# Altium project Hospital-Smart-Bracelet.PrjPcb
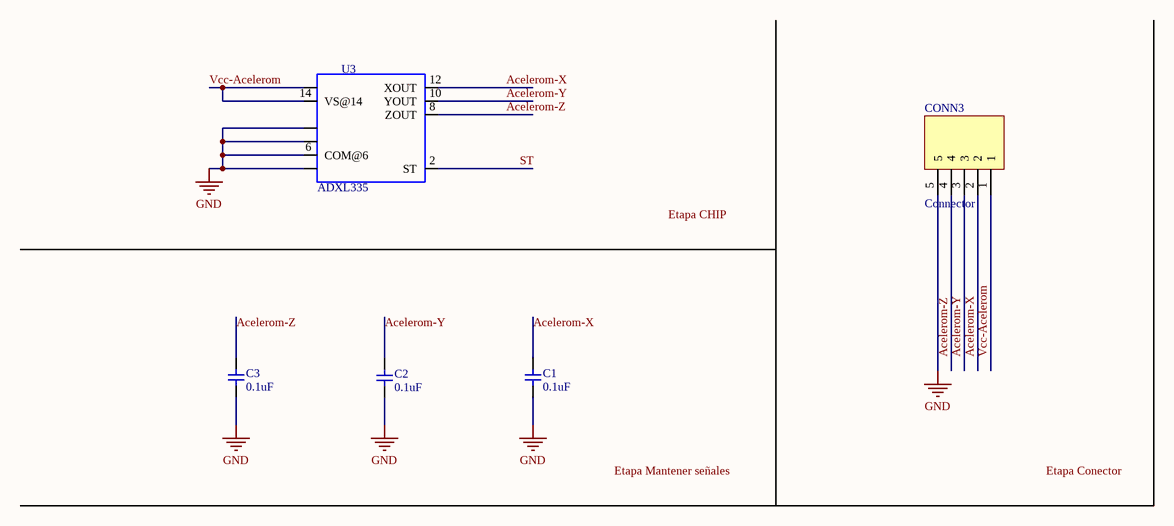
[diagram p0: SensorCaida.SchDoc]
7 sheets, 30 parts. Net scope: global (net labels, ports and power ports of the same name join across sheets).
Board file: HSB-Version1.PcbDoc
Sheets:
  SensorCaida.SchDoc
  Temperatura.SchDoc
  Atmega328P.SchDoc
  Proximidad.SchDoc
  CargaInalambrica.SchDoc
  BLE-HM10.SchDoc
  PPM.SchDoc

## Sheet SensorCaida.SchDoc
size A4

### Parts
C1  value 0.1uF  [C1206-1.00]  (hidden comment: C)
C2  value 0.1uF  [C1206-1.00]  (hidden comment: C)
C3  value 0.1uF  [C1206-1.00]  (hidden comment: C)
CONN3  Connector  [1x5x2.54 Pin Header TH V]
U3  ADXL335  [*LFCSP-16]

### Nets
GND: C2.2 C3.2 CONN3.5 U3.3(COM@3) U3.5(COM@5) U3.6(COM@6) U3.7(COM@7)
Acelerom-X: C1.1 CONN3.2 U3.12(XOUT)  [project net A2]
Acelerom-Y: CONN3.3 U3.10(YOUT)  [project net A3]
Acelerom-Z: C3.1 CONN3.4 U3.8(ZOUT)  [project net A4]
ST: U3.2(ST)
Vcc-Acelerom: CONN3.1 U3.14(VS@14) U3.15(VS@15)  [project net D10]

Not connected (* = marked no-connect by the designer): C1 2; C2 1

### Notes on the sheet
- Labels drawn without touching a wire or pin: Etapa CHIP, Etapa Conector, Etapa Mantener señales

### Library data of the parts
C1-C3 = C: Capacitor, generic
CONN3 = Header 1x5
U3 = ADXL335: AcelerÃ³metro X, Y, Eje Z Â± 3g 1.6kHz _X, Y_, 550Hz _Z_ 16-LFCSP-LQ _4x4_; MF: Analog Devices; Price: None; SnapEDA_Link: https://www.snapeda.com/parts/ADXL335/Analog%20Devices%20Inc./view-part/3215445/?ref=snap; Availability: Unavailable; Package: LFCSP-16 Analog Devices; MP: ADXL335; Value: *; URL: https://www.snapeda.com/home/

## Sheet Temperatura.SchDoc
size A4
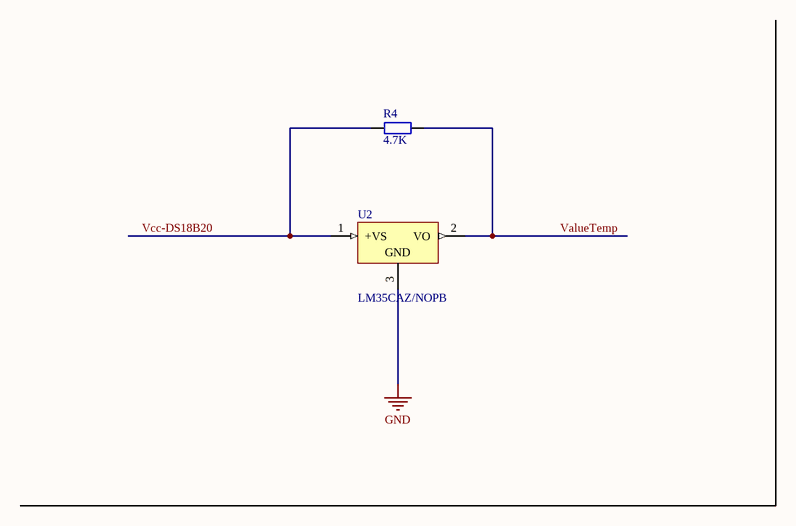
[diagram p1: Temperatura.SchDoc]

### Parts
R4  value 4.7K  [R1206-0.55]  (hidden comment: R)
U2  LM35CAZ/NOPB  [Z03A]

### Nets
GND: U2.3(GND)
ValueTemp: R4.1 U2.2(VO)  [project net D6]
Vcc-DS18B20: R4.2 U2.1(+VS)  [project net D5]

### Library data of the parts
R4 = R: Resistor, generic
U2 = LM35CAZ/NOPB: Precision Centigrade Temperature Sensor, 3-pin TO-92, Pb-Free; Manufacturer: National Semiconductor; PackageTopMarking: NSXYTT*LM35*CAZ; PowerWise: N; CompType: Temp Sensor IC; Published: 1-Mar-2010; DatasheetVersion: Nov-2000; PackageVersion: revG, Sep-2000; PackageReference: Z03A; Publisher: Altium Limited; PackageDescription: TO-92, Molded, 3 Lead; Supplier 1: Digi-Key; Supplier Part Number 1: LM35CAZ-ND; Supplier 2: Farnell; Supplier Part Number 2: 1469232; PartNumber: LM35CAZ/NOPB; RoHS: Y; PinCount: 3; Code_JEDEC: TO-226-AA; ComponentLink1Description: LM35 Datasheet; ComponentLink1URL: http://www.national.com/ds/LM/LM35.pdf; ComponentLink2Description: LM35 Web Page; ComponentLink2URL: http://www.national.com/pf/LM/LM35.html; ComponentLink3Description: Z03A Package Page; ComponentLink3URL: http://www.national.com/packaging/folders/z03a.html

## Sheet Atmega328P.SchDoc
size A4
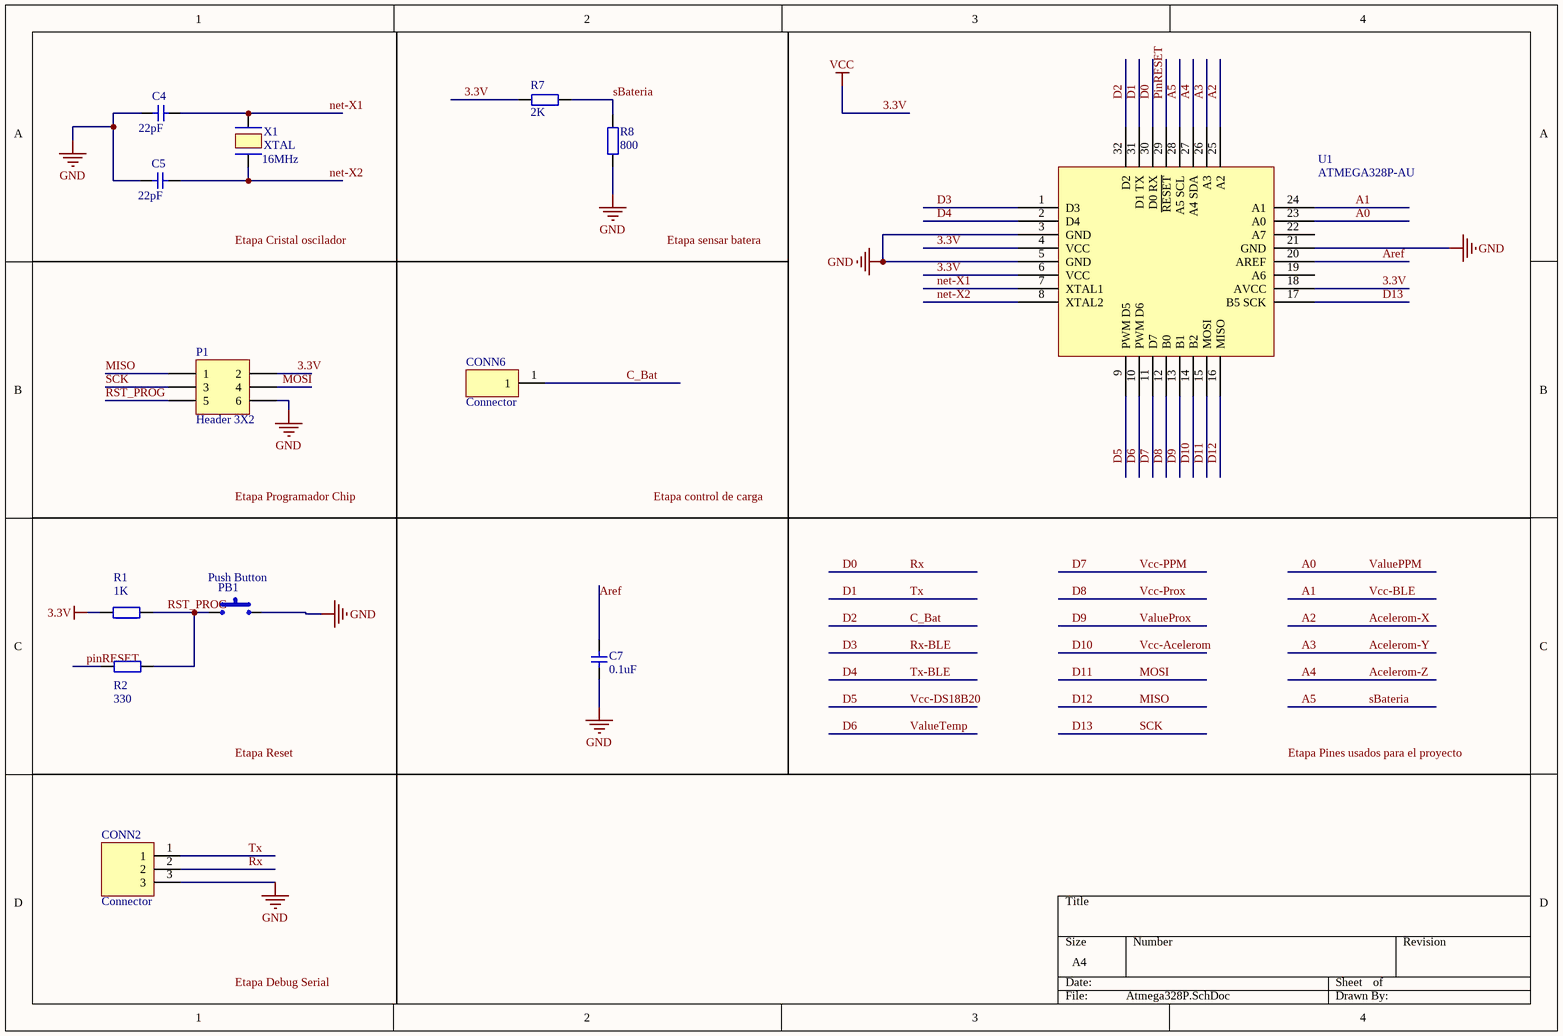
[diagram p2: Atmega328P.SchDoc]

### Parts
C4  value 22pF  [C1206-1.25]  (hidden comment: C1)
C5  value 22pF  [C1206-1.25]  (hidden comment: C2)
C7  value 0.1uF  [C1206-1.25]  (hidden comment: C2)
CONN2  Connector  [1x3x2.54 Pin Header TH V]
CONN6  Connector  [1x1x2.54 Pin Header TH V]
P1  Header 3X2  [HDR2X3]
PB1  Push Button  [Tack Switch 6x6 1mm TH]
R1  value 1K  [R1206-0.55]  (hidden comment: R)
R2  value 330  [R1206-0.55]  (hidden comment: R)
R7  value 2K  [R1206-0.55]  (hidden comment: R)
R8  value 800  [R1206-0.55]  (hidden comment: R)
U1  ATMEGA328P-AU  [TQFP80P900X900X120-32N]
X1  XTAL  value 16MHz  [2-SMD]

### Nets
3.3V: P1.2 R1.1 R7.2 U1.4(VCC) U1.6(VCC) U1.18(AVCC)  [also labelled VCC]
GND: C4.1 C5.1 C7.1 CONN2.3 P1.6 PB1.2 R8.1 U1.3(GND) U1.5(GND) U1.21(GND)
A0: U1.23(A0)  [also labelled ValuePPM]
A1: U1.24(A1)  [also labelled Vcc-BLE]
A2: U1.25(A2)  [also labelled Acelerom-X]
A3: U1.26(A3)  [also labelled Acelerom-Y]
A4: U1.27(A4_SDA)  [also labelled Acelerom-Z]
A5: R7.1 R8.2 U1.28(A5_SCL)  [also labelled sBateria]
Aref: C7.2 U1.20(AREF)
C_Bat: CONN6.1 U1.32(D2)  [also labelled D2]
D0: CONN2.2 U1.30(D0_RX)  [also labelled Rx]
D1: CONN2.1 U1.31(D1_TX)  [also labelled Tx]
D3: U1.1(D3)  [also labelled Rx-BLE]
D4: U1.2(D4)  [also labelled Tx-BLE]
D5: U1.9(PWM_D5)  [also labelled Vcc-DS18B20]
D6: U1.10(PWM_D6)  [also labelled ValueTemp]
D7: U1.11(D7)  [also labelled Vcc-PPM]
D8: U1.12(B0)  [also labelled Vcc-Prox]
D9: U1.13(B1)  [also labelled ValueProx]
D10: U1.14(B2)  [also labelled Vcc-Acelerom]
D11: P1.4 U1.15(MOSI)  [also labelled MOSI]
D12: P1.1 U1.16(MISO)  [also labelled MISO]
D13: P1.3 U1.17(B5_SCK)  [also labelled SCK]
net-X1: C4.2 U1.7(XTAL1) X1.2
net-X2: C5.2 U1.8(XTAL2) X1.1
pinRESET: R2.1 U1.29(~{RESET})
RST_PROG: P1.5 PB1.1 R1.2 R2.2

Not connected (* = marked no-connect by the designer): U1 19(A6) 22(A7)

### Notes on the sheet
- Labels drawn without touching a wire or pin: Etapa control de carga, Etapa Cristal oscilador, Etapa Debug Serial, Etapa Pines usados para el proyecto, Etapa Programador Chip, Etapa Reset, Etapa sensar batera

### Library data of the parts
C4 C5 C7 = C: Capacitor, generic
CONN2 = Header 1x3: Rx / Tx
CONN6 = Header 1x1: Sen Batery
P1 = Header 3X2: Header, 3-Pin, Dual row; LatestRevisionDate: 17-Jul-2002; LatestRevisionNote: Re-released for DXP Platform.; Publisher: Altium Limited
R1 R2 R7 R8 = R: Resistor, generic
U1 = ATMEGA328P-AU: Microchip Technology ATMEGA328P-AN, 8bit AVR Microcontroller, 20MHz, 32 kB Flash, 32-Pin TQFP; Company: Gueni; Created By: Mohamed Gueni; Date: 20 October 2018; RS Stock No: 131-0271; Datasheet URL: https://docs-emea.rs-online.com/webdocs/15b8/0900766b815b8e7b.pdf
X1 = XTAL: Crystal, Generic

## Sheet Proximidad.SchDoc
size A4
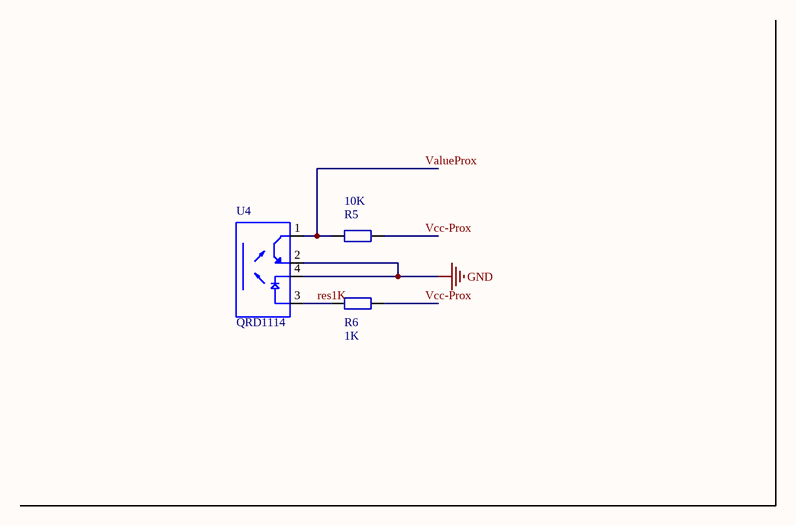
[diagram p3: Proximidad.SchDoc]

### Parts
R5  value 10K  [R1206-0.55]  (hidden comment: R)
R6  value 1K  [R1206-0.55]  (hidden comment: R)
U4  QRD1114  [*ONS_QRD1114]

### Nets
GND: U4.2(ET) U4.4(C)
res1K: R6.1 U4.3(A)
ValueProx: R5.1 U4.1(CT)  [project net D9]
Vcc-Prox: R5.2 R6.2  [project net D8]

### Library data of the parts
R5 R6 = R: Resistor, generic
U4 = QRD1114: Sensor Ã³ptico reflectante 0.050 _1.27 mm_ radial - 4 conductores; MF: ON Semiconductor; Digi-Key_Part_Number: QRD1114-ND; Package: Radial-4 ON Semiconductor; SnapEDA_Link: https://www.snapeda.com/parts/QRD1114/ON%20Semiconductor/view-part/2706462/?ref=snap; Digi-Key_Purchase_URL: https://www.digikey.com/product-detail/en/on-semiconductor/QRD1114/QRD1114-ND/187536?utm_source=snapeda&utm_medium=aggregator&utm_campaign=symbol; MP: QRD1114; Value: *

## Sheet CargaInalambrica.SchDoc
size A4
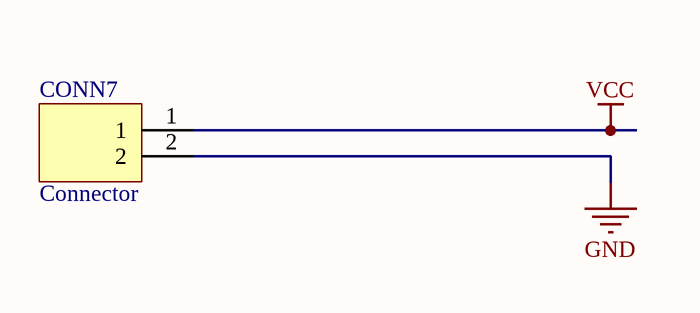
[diagram p4: CargaInalambrica.SchDoc]

### Parts
CONN7  Connector  [1x2x2.54 Pin Header TH V]

### Nets
GND: CONN7.2
VCC: CONN7.1  [project net 3.3V]

### Library data of the parts
CONN7 = Header 1x2

## Sheet BLE-HM10.SchDoc
size A4
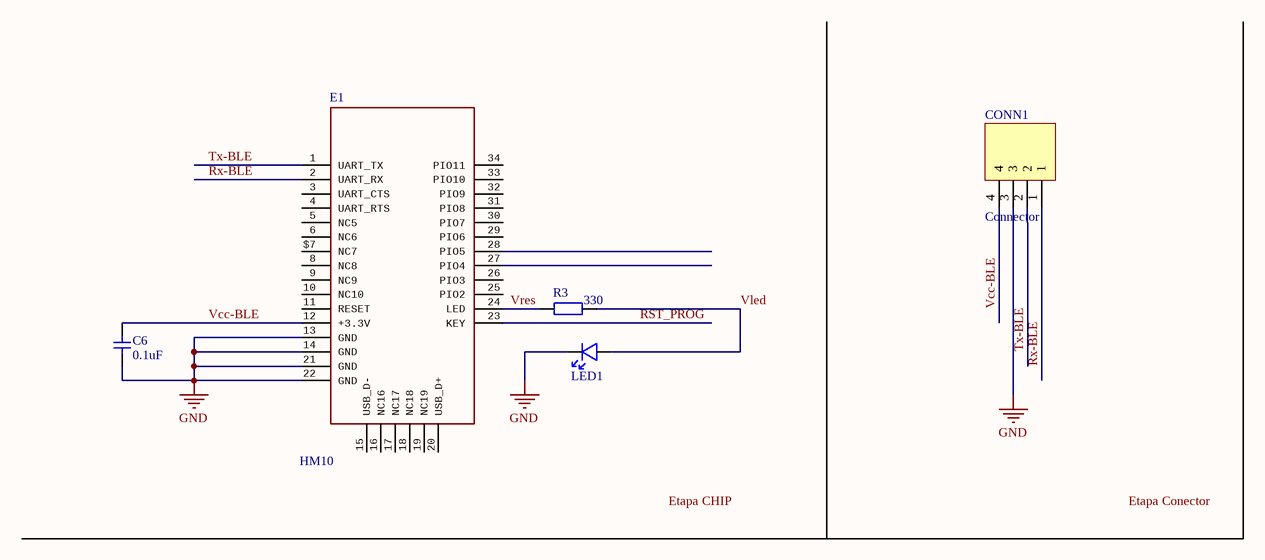
[diagram p5: BLE-HM10.SchDoc]

### Parts
C6  value 0.1uF  [C1206-1.25]  (hidden comment: C2)
CONN1  Connector  [1x4x2.54 Pin Header TH V]
E1  value HM10  [26.9X13X2.2_BOARD]  (hidden comment: HM Bluetooth module use TI CC2540 or CC2541, Master and slave roles in one, transmission version and remote control version and PIO state acquisition functions in one, Support the AT command modify module parameters, Convenient and flexible.)
LED1  LED  [SMT1206-LED]  (value not drawn)
R3  value 330  [R1206-0.55]  (hidden comment: R)

### Nets
GND: C6.1 CONN1.3 E1.13(GND) E1.14(GND) E1.21(GND) E1.22(GND) LED1.2
RST_PROG: E1.23(KEY)
Rx-BLE: CONN1.1 E1.2(UART_RX)  [project net D3]
Tx-BLE: CONN1.2 E1.1(UART_TX)  [project net D4]
Vcc-BLE: C6.2 CONN1.4 E1.12(+3.3V)  [project net A1]
Vled: LED1.1 R3.2
Vres: E1.24(LED) R3.1

Not connected (* = marked no-connect by the designer): E1 3(UART_CTS) 4(UART_RTS) 5(NC5) 6(NC6) 8(NC8) 9(NC9) 10(NC10) 11(RESET) 15(USB_D-) 16(NC16) 17(NC17) 18(NC18) 19(NC19) 20(USB_D+) 25(PIO2) 26(PIO3) 27(PIO4) 28(PIO5) 29(PIO6) 30(PIO7) 31(PIO8) 32(PIO9) 33(PIO10) 34(PIO11) $7(NC7)

### Notes on the sheet
- Labels drawn without touching a wire or pin: Etapa CHIP, Etapa Conector

### Library data of the parts
C6 = C: Capacitor, generic
CONN1 = Header 1x4: Header
E1 = HM-10-BOARD: HM10 BLE
LED1 = LED: *
R3 = R: Resistor, generic

## Sheet PPM.SchDoc
size A4
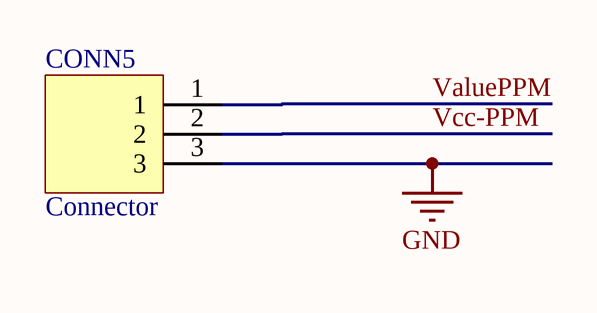
[diagram p6: PPM.SchDoc]

### Parts
CONN5  Connector  [SEN0203]

### Nets
GND: CONN5.3
ValuePPM: CONN5.1  [project net A0]
Vcc-PPM: CONN5.2  [project net D7]

### Library data of the parts
CONN5 = Header 1x3: Con PPM

## Nets that join several sheets
3.3V: Atmega328P (6 pins), CargaInalambrica (CONN7.1)
GND: SensorCaida (7 pins), Temperatura (U2.3), Atmega328P (10 pins), Proximidad (U4.2 U4.4), CargaInalambrica (CONN7.2), BLE-HM10 (7 pins), PPM (CONN5.3)
A0: Atmega328P (U1.23), PPM (CONN5.1)
A1: Atmega328P (U1.24), BLE-HM10 (C6.2 CONN1.4 E1.12)
A2: SensorCaida (C1.1 CONN3.2 U3.12), Atmega328P (U1.25)
A3: SensorCaida (CONN3.3 U3.10), Atmega328P (U1.26)
A4: SensorCaida (C3.1 CONN3.4 U3.8), Atmega328P (U1.27)
D3: Atmega328P (U1.1), BLE-HM10 (CONN1.1 E1.2)
D4: Atmega328P (U1.2), BLE-HM10 (CONN1.2 E1.1)
D5: Temperatura (R4.2 U2.1), Atmega328P (U1.9)
D6: Temperatura (R4.1 U2.2), Atmega328P (U1.10)
D7: Atmega328P (U1.11), PPM (CONN5.2)
D8: Atmega328P (U1.12), Proximidad (R5.2 R6.2)
D9: Atmega328P (U1.13), Proximidad (R5.1 U4.1)
D10: SensorCaida (CONN3.1 U3.14 U3.15), Atmega328P (U1.14)
RST_PROG: Atmega328P (P1.5 PB1.1 R1.2 R2.2), BLE-HM10 (E1.23)